# Altium schematic sheet balancer.SchDoc
size A4
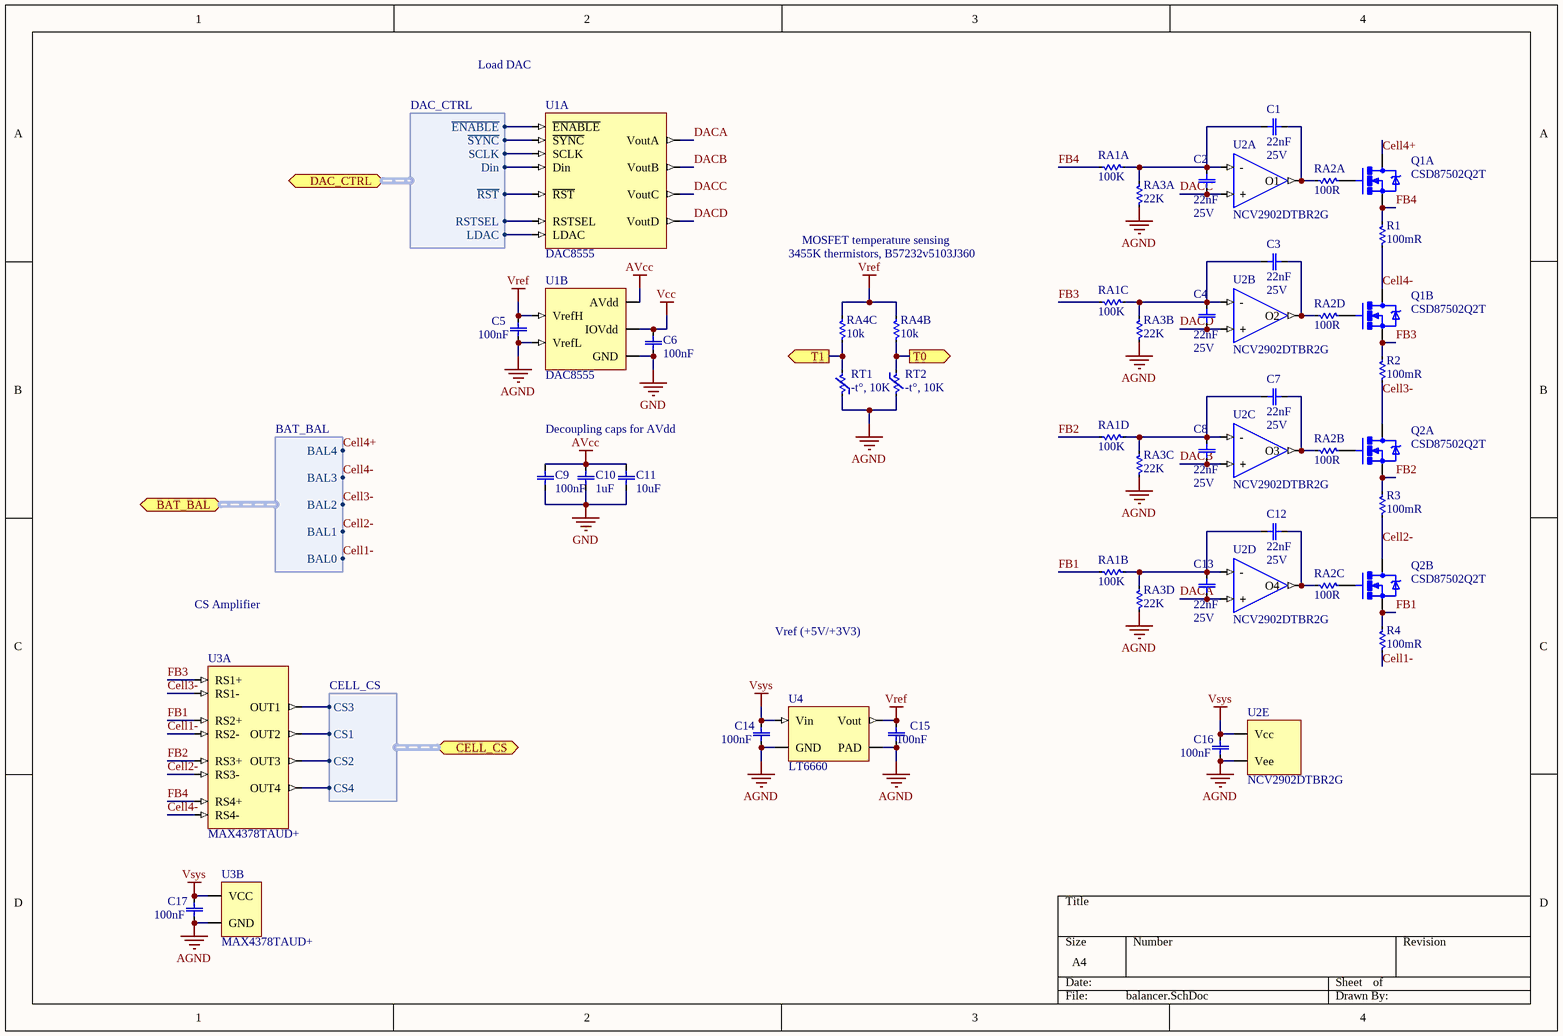
[diagram p0: balancer.SchDoc]

## Parts
C1  Capacitance: 22nF  [CAP0402]  (hidden comment: 25V)
C2  Capacitance: 22nF  [CAP0402]  (hidden comment: 25V)
C3  Capacitance: 22nF  [CAP0402]  (hidden comment: 25V)
C4  Capacitance: 22nF  [CAP0402]  (hidden comment: 25V)
C5  100nF  [CAP0402]
C6  100nF  [CAP0402]
C7  Capacitance: 22nF  [CAP0402]  (hidden comment: 25V)
C8  Capacitance: 22nF  [CAP0402]  (hidden comment: 25V)
C9  100nF  [CAP0402]
C10  1uF  [CAP0603]
C11  10uF  [CAP0603]
C12  Capacitance: 22nF  [CAP0402]  (hidden comment: 25V)
C13  Capacitance: 22nF  [CAP0402]  (hidden comment: 25V)
C14  100nF  [CAP0402]
C15  100nF  [CAP0402]
C16  100nF  [CAP0402]
C17  100nF  [CAP0402]
Q1  CSD87502Q2T  [SON65P200X80_HS-7L_DUALFET]  (parts A,B of 2)
Q2  CSD87502Q2T  [SON65P200X80_HS-7L_DUALFET]  (parts A,B of 2)
R1  100mR  [RES0402]
R2  100mR  [RES0402]
R3  100mR  [RES0402]
R4  100mR  [RES0402]
RA1  100K  [CAC-80P319X159-8M]  (parts A,B,C,D of 4)
RA2  100R  [CAC-50P200X100-8L]  (parts A,B,C,D of 4)
RA3  22K  [CAC-80P319X159-8M]  (parts A,B,C,D of 4)
RA4  Resistance: 10k  [CAC-50P200X100-8L]  (hidden comment: quad_resistor)  (parts B,C of 4)
RT1  -t°, 10K  [RES0402]
RT2  -t°, 10K  [RES0402]
U1  DAC8555  [TSOP65P640X120-16L]  (parts A,B of 2)
U2  NCV2902DTBR2G  [TSOP65P640X120-14L]  (parts A,B,C,D,E of 5)
U3  MAX4378TAUD+  [TSOP65P640X120-14L]  (parts A,B of 2)
U4  LT6660  [DFN50P200X200X75_4L_EP]

## Ports
BAT_BAL (harness BAT_BAL), CELL_CS (harness CELL_CS), DAC_CTRL (harness DAC_CTRL), T0 (out), T1 (out)

## Harnesses
BAT_BAL: BAL0, BAL1, BAL2, BAL3, BAL4
CELL_CS: CS3, CS1, CS2, CS4
DAC_CTRL: ~{ENABLE}, ~{SYNC}, SCLK, Din, ~{RST}, RSTSEL, LDAC

## Nets
AGND: C5.1 C14.2 C15.1 C16.2 C17.2 RA3.1 RA3.2 RA3.3 RA3.4 RT1.1 RT2.2 U1.5(VrefL) U2.11(Vee) U3.11(GND) U4.2(GND) U4.4(PAD)
AVcc: C9.2 C10.2 C11.2 U1.4(AVdd)
GND: C6.1 C9.1 C10.1 C11.1 U1.6(GND)
Vcc: C6.2 U1.12(IOVdd)
Vref: C5.2 C15.2 RA4.3 RA4.4 U1.3(VrefH) U4.1(Vout)
Vsys: C14.1 C16.1 C17.1 U2.4(Vcc) U3.4(VCC) U4.3(Vin)
Cell1-: R4.2 U3.6(RS2-) ; port BAT_BAL.BAL0
Cell2-: Q2.D2 R3.2 U3.9(RS3-) ; port BAT_BAL.BAL1
Cell3-: Q2.D1 R2.2 U3.2(RS1-) ; port BAT_BAL.BAL2
Cell4+: Q1.D1 ; port BAT_BAL.BAL4
Cell4-: Q1.D2 R1.1 U3.13(RS4-) ; port BAT_BAL.BAL3
DACA: C13.1 U1.1(VoutA) U2.12(+)
DACB: C8.1 U1.2(VoutB) U2.10(+)
DACC: C2.1 U1.7(VoutC) U2.3(+)
DACD: C4.1 U1.8(VoutD) U2.5(+)
FB1: Q2.S2 R4.1 RA1.3 U3.5(RS2+)
FB2: Q2.S1 R3.1 RA1.2 U3.10(RS3+)
FB3: Q1.S2 R2.1 RA1.4 U3.3(RS1+)
FB4: Q1.S1 R1.2 RA1.1 U3.12(RS4+)
T0: RA4.6 RT2.1 ; port T0
T1: RA4.5 RT1.2 ; port T1
NetC1_1: C1.1 RA2.1 U2.1(O1)
NetC1_2: C1.2 C2.2 RA1.8 RA3.8 U2.2(-)
NetC3_1: C3.1 RA2.2 U2.7(O2)
NetC3_2: C3.2 C4.2 RA1.5 RA3.6 U2.6(-)
NetC7_1: C7.1 RA2.3 U2.8(O3)
NetC7_2: C7.2 C8.2 RA1.7 RA3.5 U2.9(-)
NetC12_1: C12.1 RA2.4 U2.14(O4)
NetC12_2: C12.2 C13.2 RA1.6 RA3.7 U2.13(-)
NetQ1_G1: Q1.G1 RA2.8
NetQ1_G2: Q1.G2 RA2.7
NetQ2_G1: Q2.G1 RA2.6
NetQ2_G2: Q2.G2 RA2.5
NetU1_9: U1.9(~{SYNC}) ; port DAC_CTRL.~{SYNC}
NetU1_10: U1.10(SCLK) ; port DAC_CTRL.SCLK
NetU1_11: U1.11(Din) ; port DAC_CTRL.Din
NetU1_13: U1.13(~{RST}) ; port DAC_CTRL.~{RST}
NetU1_14: U1.14(RSTSEL) ; port DAC_CTRL.RSTSEL
NetU1_15: U1.15(~{ENABLE}) ; port DAC_CTRL.~{ENABLE}
NetU1_16: U1.16(LDAC) ; port DAC_CTRL.LDAC
NetU3_1: U3.1(OUT1) ; port CELL_CS.CS3
NetU3_7: U3.7(OUT2) ; port CELL_CS.CS1
NetU3_8: U3.8(OUT3) ; port CELL_CS.CS2
NetU3_14: U3.14(OUT4) ; port CELL_CS.CS4

## Notes on the sheet
- Load DAC
- MOSFET temperature sensing
- 3455K thermistors, B57232v5103J360
- Decoupling caps for AVdd
- CS Amplifier
- Vref (+5V/+3V3)

## Library data of the parts
C1-C4 C7 C8 C12 C13 = capacitor: Tolerance: 10%; Dielectric: X5R; Voltage: 25V
C5 C6 C9-C11 C14-C17 = capacitor
Q1 Q2 = DUAL-MOSFET-N: PROD_ID: IC-08089
R1-R4 = resistor
RA1-RA3 = quad_resistor
RT1 = thermistor: R0: 10R
RT2 = thermistor
U1 = DAC8555: 16-BIT, QUAD CHANNEL, ULTRA-LOW GLITCH, VOLTAGE OUTPUT  DIGITAL-TO-ANALOG CONVERTER
U2 = QUAD_OPAMP
U3 = MAX4378: Quad, High-Side Current-Sense Amplifier with Internal Gain
U4 = LT6660: Tiny Micropower Precision Series References in 2mm × 2mm DFN